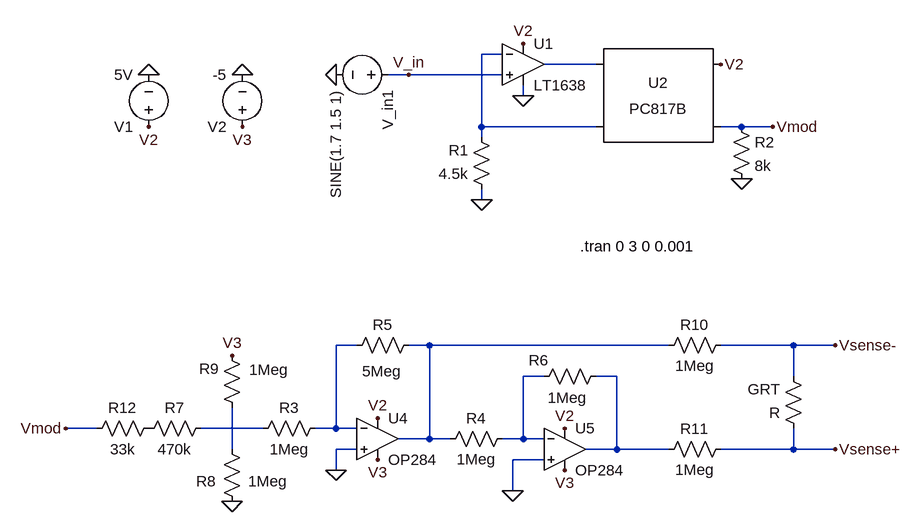
[diagram p0: schematic LAB002_BackgroundCircuit.asc]
LAB002_BackgroundCircuit.asc, the LTspice schematic file:
Version 4
SHEET 1 1076 924
WIRE -48 144 -80 144
WIRE 96 160 16 160
WIRE -192 176 -224 176
WIRE -48 176 -192 176
WIRE -16 208 -16 192
WIRE -80 256 -80 144
WIRE 96 256 -80 256
WIRE 320 256 288 256
WIRE 368 256 320 256
WIRE -80 272 -80 256
WIRE -80 368 -80 352
WIRE -272 592 -304 592
WIRE -160 592 -192 592
WIRE 208 592 -160 592
WIRE 400 592 288 592
WIRE 464 592 400 592
WIRE 16 640 -16 640
WIRE 128 640 96 640
WIRE 400 640 400 592
WIRE -672 720 -720 720
WIRE -416 720 -512 720
WIRE -304 720 -304 592
WIRE -304 720 -336 720
WIRE -272 720 -304 720
WIRE -160 736 -160 592
WIRE -160 736 -208 736
WIRE -128 736 -160 736
WIRE -16 736 -16 640
WIRE -16 736 -48 736
WIRE 16 736 -16 736
WIRE -464 752 -464 688
WIRE -272 752 -304 752
WIRE 128 752 128 640
WIRE 128 752 80 752
WIRE 208 752 128 752
WIRE 400 752 400 720
WIRE 400 752 288 752
WIRE 464 752 400 752
WIRE 16 768 -32 768
WIRE -304 784 -304 752
WIRE -32 816 -32 768
FLAG -304 176 0
FLAG -80 368 0
FLAG -16 208 0
FLAG 288 160 V2
FLAG -16 128 V2
FLAG -192 176 V_in
FLAG -592 256 V2
FLAG -592 176 0
FLAG -448 256 V3
FLAG -448 176 0
FLAG 320 336 0
FLAG -304 784 0
FLAG -32 816 0
FLAG -240 704 V2
FLAG 48 720 V2
FLAG -240 768 V3
FLAG 48 784 V3
FLAG 464 592 Vsense-
FLAG 464 752 Vsense+
FLAG 368 256 Vmod
FLAG -720 720 Vmod
FLAG -464 608 V3
FLAG -464 832 0
SYMBOL voltage -208 176 R90
WINDOW 123 0 0 Left 0
WINDOW 39 0 0 Left 0
SYMATTR InstName V_in1
SYMATTR Value SINE(1.7 1.5 1)
SYMBOL res -64 368 R180
WINDOW 0 36 76 Left 2
WINDOW 3 36 40 Left 2
SYMATTR InstName R1
SYMATTR Value 4.5k
SYMBOL OpAmps\\LT1638 -16 96 R0
SYMATTR InstName U1
SYMBOL Optos\\PC817B 192 208 R0
SYMATTR InstName U2
SYMBOL voltage -592 272 R180
WINDOW 123 0 0 Left 0
WINDOW 39 0 0 Left 0
SYMATTR InstName V1
SYMATTR Value 5V
SYMBOL voltage -448 272 R180
WINDOW 123 0 0 Left 0
WINDOW 39 0 0 Left 0
SYMATTR InstName V2
SYMATTR Value -5
SYMBOL res 304 240 R0
SYMATTR InstName R2
SYMATTR Value 8k
SYMBOL res -320 704 R90
WINDOW 0 0 56 VBottom 2
WINDOW 3 32 56 VTop 2
SYMATTR InstName R3
SYMATTR Value 1Meg
SYMBOL Opamps\\OP284 -240 672 R0
SYMATTR InstName U4
SYMBOL Opamps\\OP284 48 688 R0
SYMATTR InstName U5
SYMBOL res -32 720 R90
WINDOW 0 0 56 VBottom 2
WINDOW 3 32 56 VTop 2
SYMATTR InstName R4
SYMATTR Value 1Meg
SYMBOL res -176 576 R90
WINDOW 0 0 56 VBottom 2
WINDOW 3 40 57 VTop 2
SYMATTR InstName R5
SYMATTR Value 5Meg
SYMBOL res 112 624 R90
WINDOW 0 7 104 VBottom 2
WINDOW 3 33 60 VTop 2
SYMATTR InstName R6
SYMATTR Value 1Meg
SYMBOL res -496 704 R90
WINDOW 0 0 56 VBottom 2
WINDOW 3 32 56 VTop 2
SYMATTR InstName R7
SYMATTR Value 470k
SYMBOL res -448 848 R180
WINDOW 0 40 47 Left 2
WINDOW 3 -70 47 Left 2
SYMATTR InstName R8
SYMATTR Value 1Meg
SYMBOL res -448 704 R180
WINDOW 0 36 76 Left 2
WINDOW 3 -71 74 Left 2
SYMATTR InstName R9
SYMATTR Value 1Meg
SYMBOL res 304 576 R90
WINDOW 0 0 56 VBottom 2
WINDOW 3 32 56 VTop 2
SYMATTR InstName R10
SYMATTR Value 1Meg
SYMBOL res 304 736 R90
WINDOW 0 0 56 VBottom 2
WINDOW 3 32 56 VTop 2
SYMATTR InstName R11
SYMATTR Value 1Meg
SYMBOL res 416 736 R180
WINDOW 0 36 76 Left 2
WINDOW 3 36 40 Left 2
SYMATTR InstName GRT
SYMBOL res -576 704 R90
WINDOW 0 0 56 VBottom 2
WINDOW 3 32 56 VTop 2
SYMATTR InstName R12
SYMATTR Value 33k
TEXT 72 440 Left 2 !.tran 0 3 0 0.001

The netlist it stands for:
* LAB002_BackgroundCircuit.asc
V_in1 V_in 0 SINE(1.7 1.5 1)
R1 0 N001 4.5k
XU1 V_in N001 V2 0 N002 LT1638  ; pins In+ In- V+ V- OUT
XU2 N002 N001 V2 Vmod PC817 Igain=1.5m
V1 V2 0 5V
V2 V3 0 -5
R2 Vmod 0 8k
R3 N003 N007 1Meg
XU4 0 N003 V2 V3 N004 OP284  ; pins In+ In- V+ V- OUT
XU5 0 N005 V2 V3 N006 OP284  ; pins In+ In- V+ V- OUT
R4 N005 N004 1Meg
R5 N004 N003 5Meg
R6 N006 N005 1Meg
R7 N007 P001 470k
R8 0 N008 1Meg
R9 N008 V3 1Meg
R10 Vsense- N004 1Meg
R11 Vsense+ N006 1Meg
R§GRT Vsense+ Vsense- R
R12 P001 Vmod 33k
.tran 0 3 0 0.001
.lib PC817.sub
.lib ADI1.lib
.backanno
.end